# Altium schematic sheet Project.SchDoc
size 250 x 180 mm
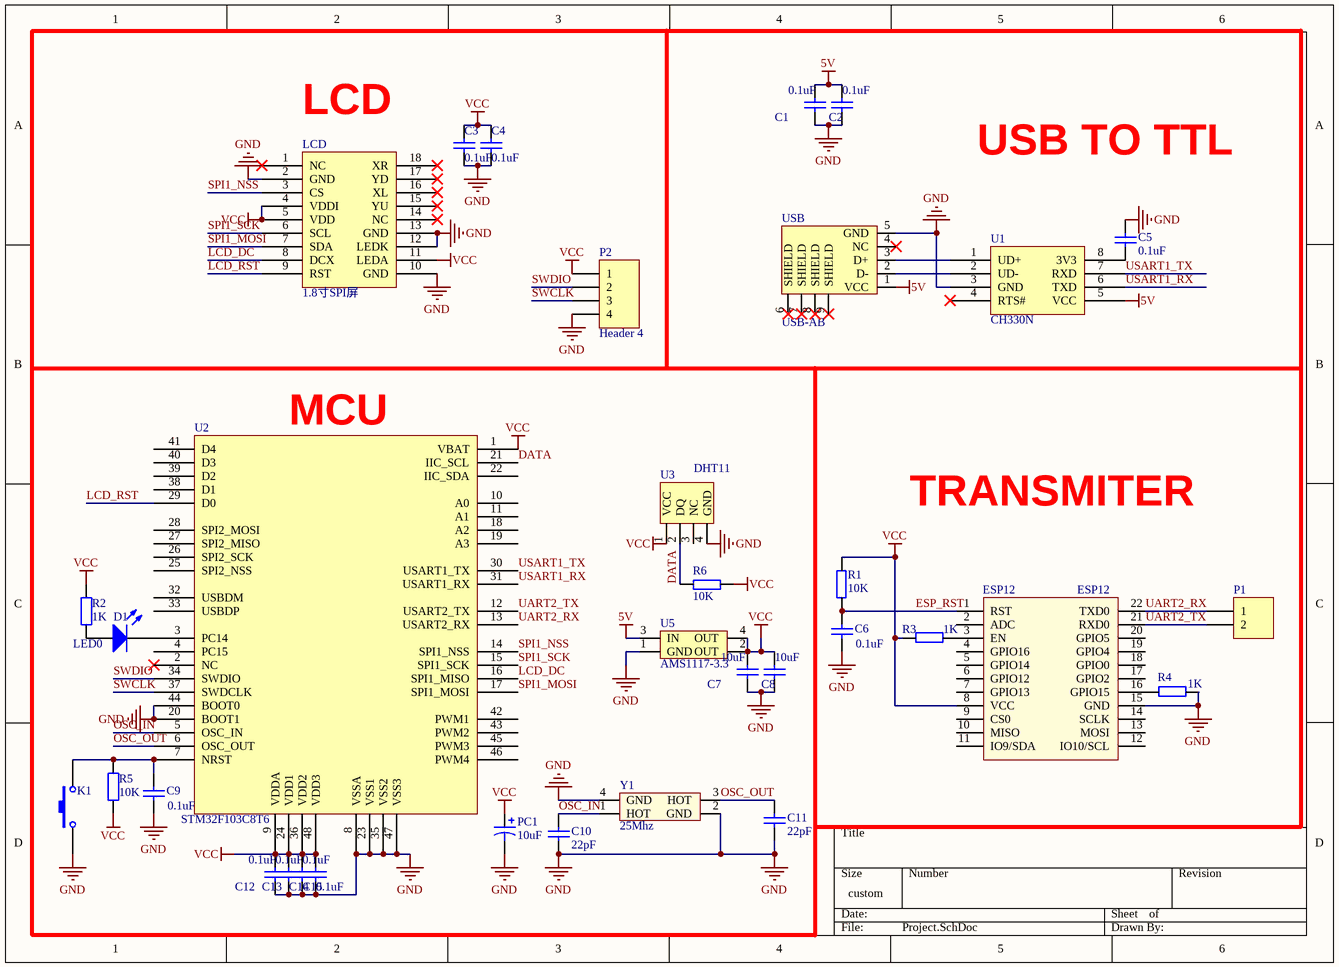
[diagram p0: Project.SchDoc]

## Parts
C1  value 0.1uF  [0603P]  (hidden comment: Cap)
C2  value 0.1uF  [0603P]  (hidden comment: Cap)
C3  value 0.1uF  [1206]  (hidden comment: Cap)
C4  value 0.1uF  [0603P]  (hidden comment: Cap)
C5  value 0.1uF  [0603P]  (hidden comment: Cap)
C6  value 0.1uF  [0603P]  (hidden comment: Cap)
C7  value 10uF  [1206]  (hidden comment: Cap)
C8  value 10uF  [1206]  (hidden comment: Cap)
C9  value 0.1uF  [0603P]  (hidden comment: Cap)
C10  value 22pF  [0603P]  (hidden comment: Cap)
C11  value 22pF  [0603P]  (hidden comment: Cap)
C12  value 0.1uF  [0603P]  (hidden comment: Cap)
C13  value 0.1uF  [0603P]  (hidden comment: Cap)
C14  value 0.1uF  [0603P]  (hidden comment: Cap)
C15  value 0.1uF  [0603P]  (hidden comment: Cap)
D1  LED0  [SMDLED-0603]
ESP12  ESP12  [ESP-12E&F Module]
K1  KEY  [KEY_SOP3625]  (value not drawn)
LCD  1.8寸SPI屏  [FPC0.5 18Pin]
P1  Header 2  [HDR1X2]  (value not drawn)
P2  Header 4  [HDR1X4]
PC1  value 10uF  [1206]
R1  10K  [0603P]
R2  value 1K  [0603P]  (hidden comment: Res2)
R3  1K  [0603P]
R4  1K  [0603P]
R5  value 10K  [0603P]
R6  10K  [0603P]
U1  CH330N  [sop8]
U2  STM32F103C8T6  [LQFP-48]
U3  DHT11  [DHT11]
U5  AMS1117-3.3  [AMS1117]
USB  USB-AB  [USB_AB]
Y1  25Mhz  [XTAL3225]

## Nets
5V: C1.2 C2.2 U1.5(VCC) U5.3(IN) USB.1(VCC)
GND: C1.1 C2.1 C3.1 C4.1 C5.2 C6.1 C7.1 C8.1 C9.1 C10.2 C11.2 C12.1 C13.1 C14.1 C15.1 ESP12.15(GND) K1.1 LCD.2(GND) LCD.10(GND) LCD.12(LEDK) LCD.13(GND) P2.4 PC1.2 R4.1 U1.3(GND) U2.8(VSSA) U2.20(BOOT1) U2.23(VSS1) U2.35(VSS2) U2.44(BOOT0) U2.47(VSS3) U3.4(GND) U5.1(GND) USB.5(GND) Y1.2(GND) Y1.4(GND)
VCC: C3.2 C4.2 C7.2 C8.2 C12.2 C13.2 C14.2 C15.2 ESP12.8(VCC) LCD.4(VDDI) LCD.5(VDD) LCD.11(LEDA) P2.1 PC1.1 R1.1 R2.1 R3.2 R5.1 R6.2 U2.1(VBAT) U2.9(VDDA) U2.24(VDD1) U2.36(VDD2) U2.48(VDD3) U3.1(VCC) U5.2(OUT) U5.4(OUT)
DATA: R6.1 U2.21(IIC_SCL) U3.2(DQ)
ESP_RST: C6.2 ESP12.1(RST) R1.2
LCD_DC: LCD.8(DCX) U2.16(SPI1_MISO)
LCD_RST: LCD.9(RST) U2.29(D0)
OSC_IN: C10.1 U2.5(OSC_IN) Y1.1(HOT)
OSC_OUT: C11.1 U2.6(OSC_OUT) Y1.3(HOT)
SPI1_MOSI: LCD.7(SDA) U2.17(SPI1_MOSI)
SPI1_NSS: LCD.3(CS) U2.14(SPI1_NSS)
SPI1_SCK: LCD.6(SCL) U2.15(SPI1_SCK)
SWCLK: P2.3 U2.37(SWDCLK)
SWDIO: P2.2 U2.34(SWDIO)
UART2_RX: ESP12.22(TXD0) P1.1 U2.13(USART2_RX)
UART2_TX: ESP12.21(RXD0) P1.2 U2.12(USART2_TX)
USART1_RX: U1.6(TXD) U2.31(USART1_RX)
USART1_TX: U1.7(RXD) U2.30(USART1_TX)
NetC5_1: C5.1 U1.8(3V3)
NetC9_2: C9.2 K1.2 R5.2 U2.7(NRST)
NetD1_1: D1.1(A) R2.2
NetD1_2: D1.2(K) U2.3(PC14)
NetESP12_3: ESP12.3(EN) R3.1
NetESP12_16: ESP12.16(GPIO15) R4.2
NetU1_1: U1.1(UD+) USB.3(D+)
NetU1_2: U1.2(UD-) USB.2(D-)

Not connected (* = marked no-connect by the designer): ESP12 2(ADC) 4(GPIO16) 5(GPIO14) 6(GPIO12) 7(GPIO13) 9(CS0) 10(MISO) 11(IO9/SDA) 12(IO10/SCL) 13(MOSI) 14(SCLK) 17(GPIO2) 18(GPIO0) 19(GPIO4) 20(GPIO5); LCD 1(NC)* 14(NC)* 15(YU)* 16(XL)* 17(YD)* 18(XR)*; U1 4(RTS#)*; U2 2(NC)* 4(PC15) 10(A0) 11(A1) 18(A2) 19(A3) 22(IIC_SDA) 25(SPI2_NSS) 26(SPI2_SCK) 27(SPI2_MISO) 28(SPI2_MOSI) 32(USBDM) 33(USBDP) 38(D1) 39(D2) 40(D3) 41(D4) 42(PWM1) 43(PWM2) 45(PWM3) 46(PWM4); U3 3(NC); USB 4(NC)* 6(SHIELD)* 7(SHIELD)* 8(SHIELD)* 9(SHIELD)*

## Notes on the sheet
- (near LCD) LCD
- USB TO TTL
- (near U2) MCU
- TRANSMITER

## Library data of the parts
C1-C15 = Cap: Capacitor; Published: 8-Jun-2000; LatestRevisionDate: 17-Jul-2002; LatestRevisionNote: Re-released for DXP Platform.; PackageReference: RAD-0.3; Publisher: Altium Limited; PackageDescription: Radial Cap, Thru-Hole; 2 Leads; 0.3 in Pin Spacing
D1 = LED0: Typical INFRARED GaAs LED; Published: 8-Jun-2000; LatestRevisionDate: 08-Jul-2005; LatestRevisionNote: Mech Layer 1 removed.; PackageReference: LED-0; Publisher: Altium Limited; PackageDescription: LED; 2 Leads
ESP12 = ESP-12E&F Module
K1 = KEY_2: Switch; Published: 24-Mar-1999; LatestRevisionDate: 17-Jul-2002; LatestRevisionNote: Re-released for DXP Platform.; PackageReference: SPST-2; Publisher: Altium Limited
P1 = Header 2: Header, 2-Pin; LatestRevisionDate: 17-Jul-2002; LatestRevisionNote: Re-released for DXP Platform.; Publisher: Altium Limited
P2 = Header 4: Header, 4-Pin; LatestRevisionDate: 17-Jul-2002; LatestRevisionNote: Re-released for DXP Platform.; Publisher: Altium Limited
PC1 = Cap Pol3: Polarized Capacitor (Surface Mount); Published: 8-Jun-2000; LatestRevisionDate: 29-May-2009; LatestRevisionNote: IPC-7351 Footprint Added.; PackageReference: C0805; Publisher: Altium Limited; PackageDescription: Chip Capacitor
R1 R3 R4 R6 = R
R2 R5 = Res2: Resistor; Published: 8-Jun-2000; LatestRevisionDate: 17-Jul-2002; LatestRevisionNote: Re-released for DXP Platform.; PackageReference: AXIAL-0.4; Publisher: Altium Limited
  R2: PackageDescription: Axial Device, Thru-Hole; 2 Leads; 0.4 in Pin Spacing
U3 = DHT11: 数字温湿度传感器
U5 = AMS1117
USB = USB-AB: MicroUSB
Y1 = XTAL_3225: 3225贴片无源晶振